# EAGLE design OutputIndicator (EAGLE 9.5.2)
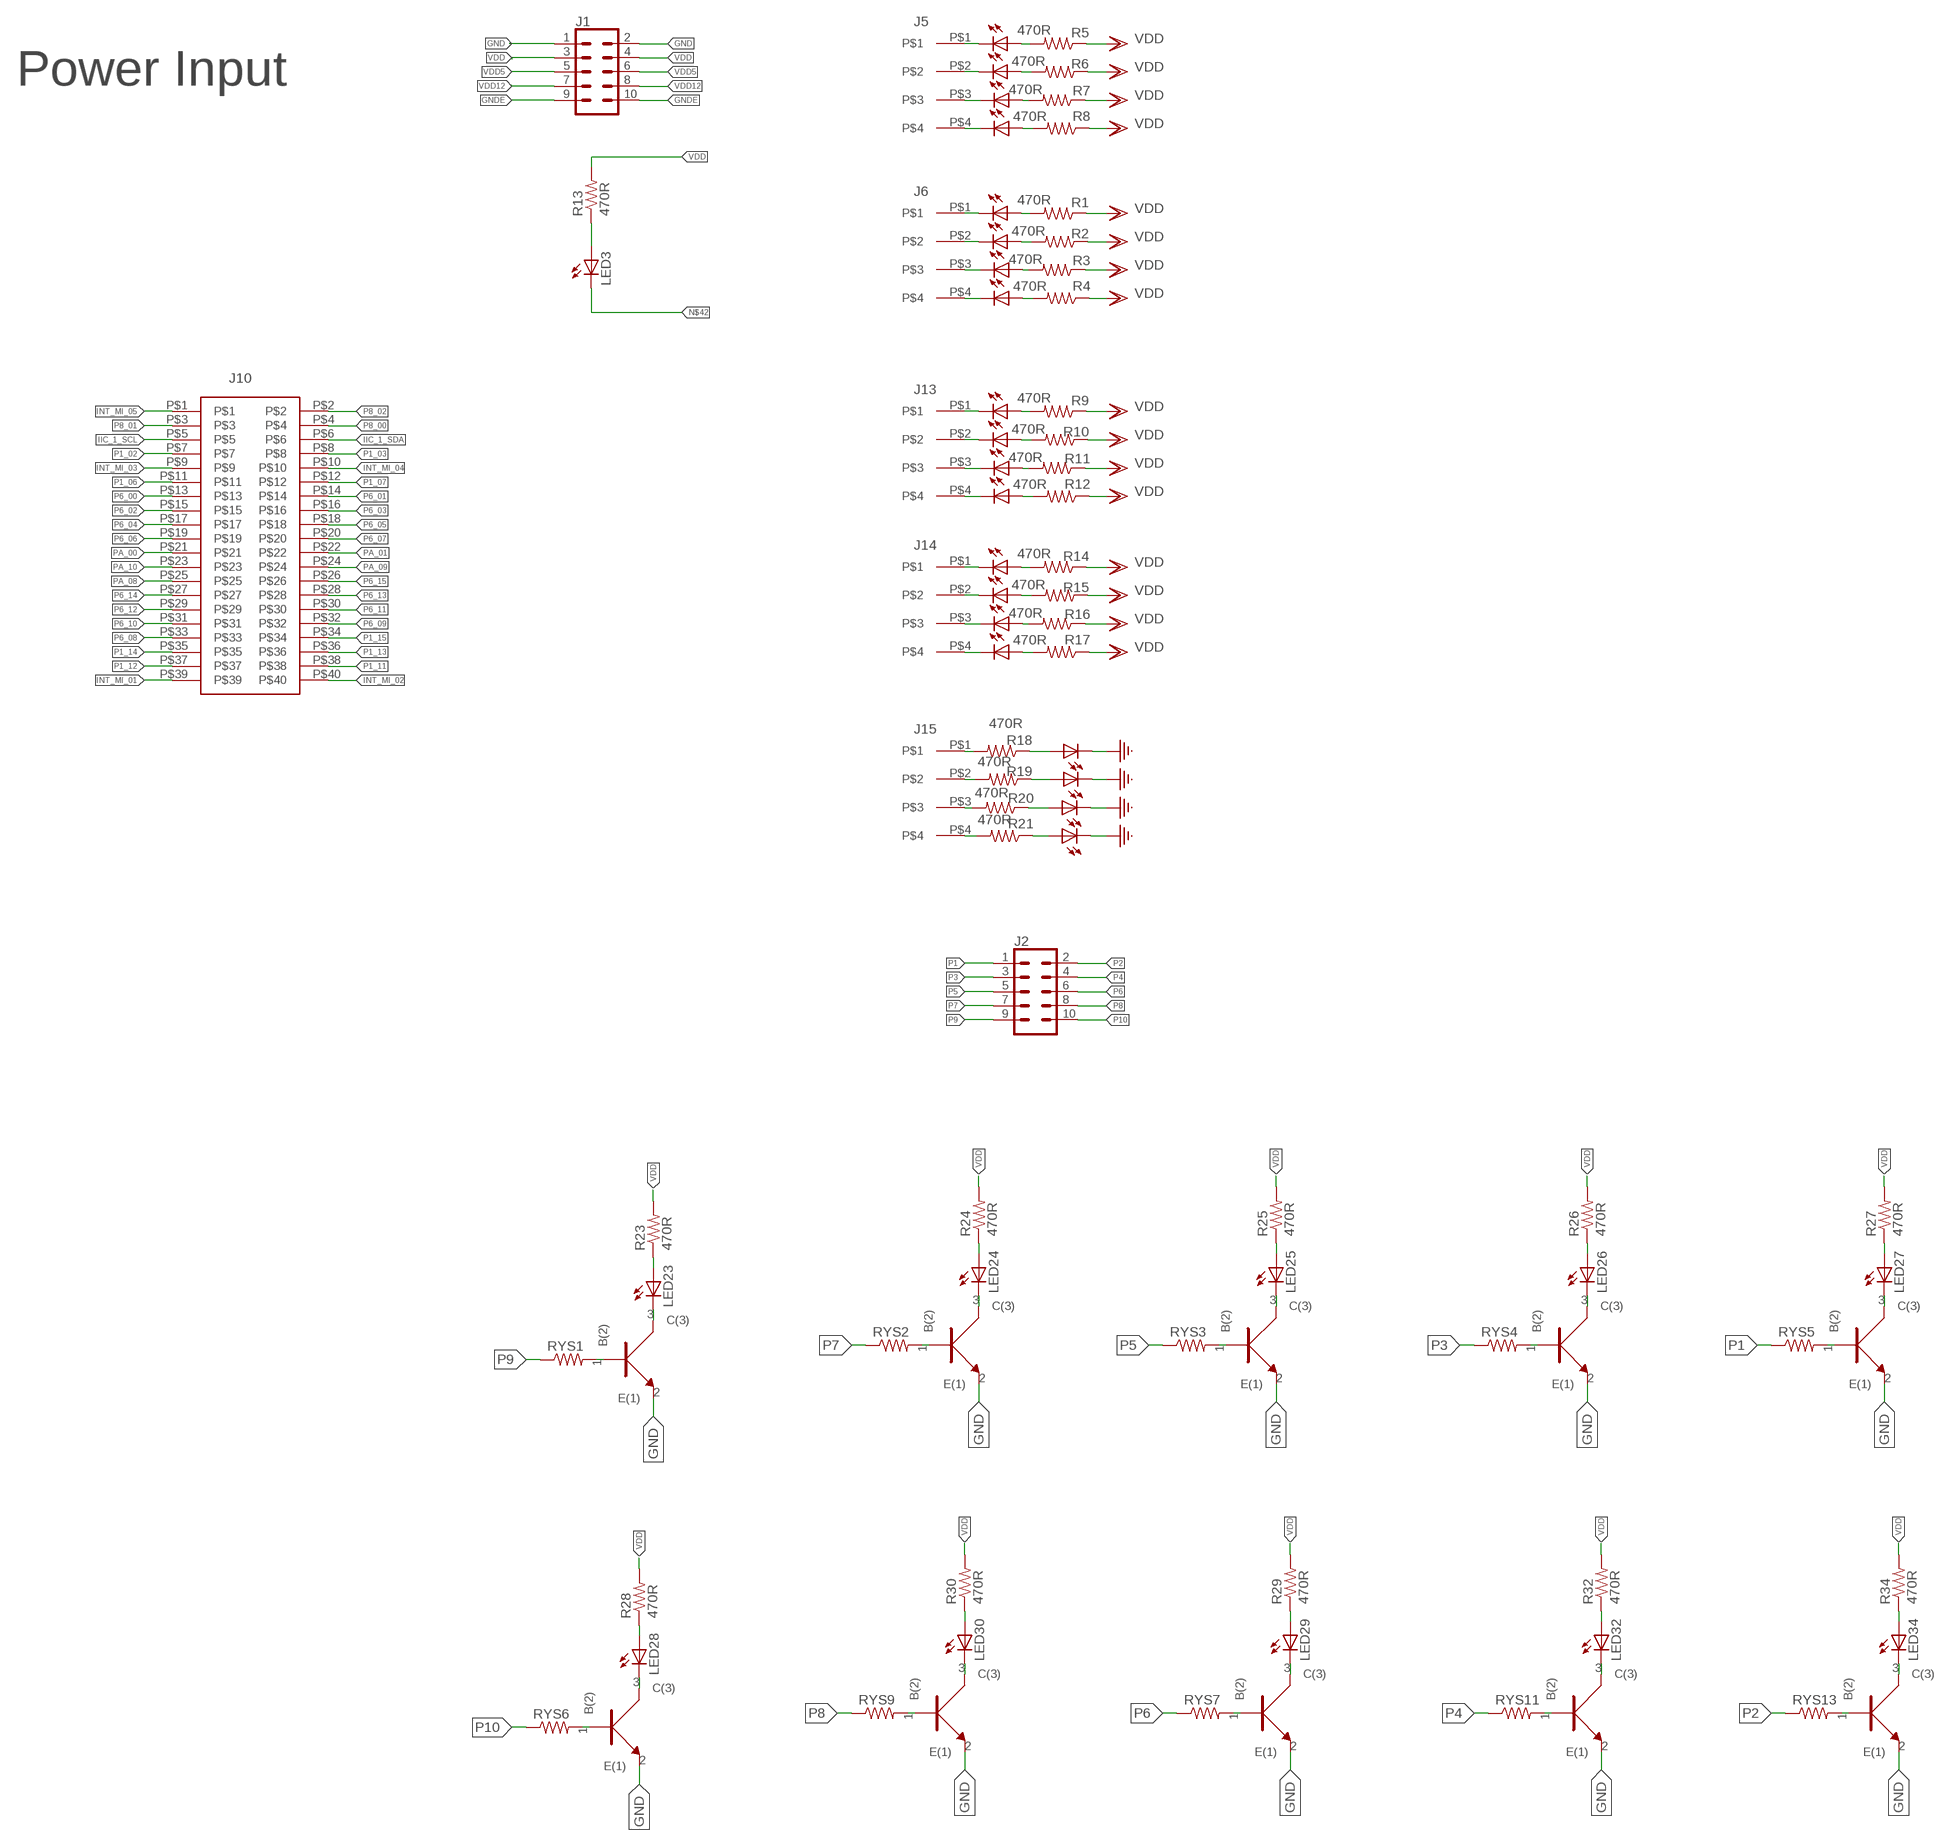
[diagram p0: schematic, sheet 1]

## Parts
J1  CONN_05X2PTH  [2X5]
J2  CONN_05X2NO_SILK  [2X5_NOSILK]
J5  3.81MM_1_X_4_RT_ANGLE_PLUG_HEADER  [1X4_3.81MM_PITCH]
J6  3.81MM_1_X_4_RT_ANGLE_PLUG_HEADER  [1X4_3.81MM_PITCH]
J10  HEADER_2_X_20_GENERIC  [HEADER_2_X_20_.1_INCH]
J13  3.81MM_1_X_4_RT_ANGLE_PLUG_HEADER  [1X4_3.81MM_PITCH]
J14  3.81MM_1_X_4_RT_ANGLE_PLUG_HEADER  [1X4_3.81MM_PITCH]
J15  3.81MM_1_X_4_RT_ANGLE_PLUG_HEADER  [1X4_3.81MM_PITCH]
LED1  LED_0805_GREEN  [LED_0805_GREEN]
LED2  LED_0805_GREEN  [LED_0805_GREEN]
LED3  LED_0805_GREEN  [LED_0805_GREEN]
LED4  LED_0805_GREEN  [LED_0805_GREEN]
LED5  LED_0805_GREEN  [LED_0805_GREEN]
LED6  LED_0805_GREEN  [LED_0805_GREEN]
LED7  LED_0805_GREEN  [LED_0805_GREEN]
LED8  LED_0805_GREEN  [LED_0805_GREEN]
LED9  LED_0805_GREEN  [LED_0805_GREEN]
LED10  LED_0805_GREEN  [LED_0805_GREEN]
LED11  LED_0805_GREEN  [LED_0805_GREEN]
LED12  LED_0805_GREEN  [LED_0805_GREEN]
LED13  LED_0805_GREEN  [LED_0805_GREEN]
LED14  LED_0805_GREEN  [LED_0805_GREEN]
LED15  LED_0805_GREEN  [LED_0805_GREEN]
LED16  LED_0805_GREEN  [LED_0805_GREEN]
LED17  LED_0805_GREEN  [LED_0805_GREEN]
LED18  LED_0805_GREEN  [LED_0805_GREEN]
LED19  LED_0805_GREEN  [LED_0805_GREEN]
LED20  LED_0805_GREEN  [LED_0805_GREEN]
LED21  LED_0805_GREEN  [LED_0805_GREEN]
LED23  LED_0805_GREEN  [LED_0805_GREEN]
LED24  LED_0805_GREEN  [LED_0805_GREEN]
LED25  LED_0805_GREEN  [LED_0805_GREEN]
LED26  LED_0805_GREEN  [LED_0805_GREEN]
LED27  LED_0805_GREEN  [LED_0805_GREEN]
LED28  LED_0805_GREEN  [LED_0805_GREEN]
LED29  LED_0805_GREEN  [LED_0805_GREEN]
LED30  LED_0805_GREEN  [LED_0805_GREEN]
LED32  LED_0805_GREEN  [LED_0805_GREEN]
LED34  LED_0805_GREEN  [LED_0805_GREEN]
R1  470R  R_0402  [0402]
R2  470R  R_0402  [0402]
R3  470R  R_0402  [0402]
R4  470R  R_0402  [0402]
R5  470R  R_0402  [0402]
R6  470R  R_0402  [0402]
R7  470R  R_0402  [0402]
R8  470R  R_0402  [0402]
R9  470R  R_0402  [0402]
R10  470R  R_0402  [0402]
R11  470R  R_0402  [0402]
R12  470R  R_0402  [0402]
R13  470R  R_0402  [0402]
R14  470R  R_0402  [0402]
R15  470R  R_0402  [0402]
R16  470R  R_0402  [0402]
R17  470R  R_0402  [0402]
R18  470R  R_0402  [0402]
R19  470R  R_0402  [0402]
R20  470R  R_0402  [0402]
R21  470R  R_0402  [0402]
R23  470R  R_0402  [0402]
R24  470R  R_0402  [0402]
R25  470R  R_0402  [0402]
R26  470R  R_0402  [0402]
R27  470R  R_0402  [0402]
R28  470R  R_0402  [0402]
R29  470R  R_0402  [0402]
R30  470R  R_0402  [0402]
R32  470R  R_0402  [0402]
R34  470R  R_0402  [0402]
RYS1  1K  R_0402  [0402]
RYS2  1K  R_0402  [0402]
RYS3  1K  R_0402  [0402]
RYS4  1K  R_0402  [0402]
RYS5  1K  R_0402  [0402]
RYS6  1K  R_0402  [0402]
RYS7  1K  R_0402  [0402]
RYS9  1K  R_0402  [0402]
RYS11  1K  R_0402  [0402]
RYS13  1K  R_0402  [0402]
U1  BC846BW  [SOT323]
U2  BC846BW  [SOT323]
U3  BC846BW  [SOT323]
U4  BC846BW  [SOT323]
U5  BC846BW  [SOT323]
U6  BC846BW  [SOT323]
U7  BC846BW  [SOT323]
U8  BC846BW  [SOT323]
U10  BC846BW  [SOT323]
U12  BC846BW  [SOT323]

## Nets
GND: J1.1 J1.2 LED18.C LED19.C LED20.C LED21.C U1.2(E(1)) U2.2(E(1)) U3.2(E(1)) U4.2(E(1)) U5.2(E(1)) U6.2(E(1)) U7.2(E(1)) U8.2(E(1)) U10.2(E(1)) U12.2(E(1))
GNDE: J1.9 J1.10
IIC_1_SCL: J10.P$5
IIC_1_SDA: J10.P$6
INT_MI_01: J10.P$39
INT_MI_02: J10.P$40
INT_MI_03: J10.P$9
INT_MI_04: J10.P$10
INT_MI_05: J10.P$1
N$1: J5.P$1 LED6.C
N$2: J5.P$2 LED7.C
N$3: LED3.A R13.P$1
N$4: J5.P$3 LED8.C
N$5: J5.P$4 LED9.C
N$6: LED9.A R8.P$2
N$7: LED8.A R7.P$2
N$8: LED7.A R6.P$2
N$9: LED6.A R5.P$2
N$10: J6.P$1 LED1.C
N$11: J6.P$2 LED2.C
N$12: J6.P$3 LED4.C
N$13: J6.P$4 LED5.C
N$14: LED5.A R4.P$2
N$15: LED2.A R2.P$2
N$16: LED1.A R1.P$2
N$17: LED4.A R3.P$2
N$18: J13.P$1 LED10.C
N$19: J13.P$2 LED11.C
N$20: J13.P$3 LED12.C
N$21: J13.P$4 LED13.C
N$22: LED13.A R12.P$2
N$23: LED11.A R10.P$2
N$24: LED10.A R9.P$2
N$25: LED12.A R11.P$2
N$26: J14.P$1 LED14.C
N$27: J14.P$2 LED15.C
N$28: J14.P$3 LED16.C
N$29: J14.P$4 LED17.C
N$30: LED17.A R17.P$2
N$31: LED15.A R15.P$2
N$32: LED14.A R14.P$2
N$33: LED16.A R16.P$2
N$34: J15.P$4 R21.P$2
N$35: J15.P$3 R20.P$2
N$36: J15.P$2 R19.P$2
N$37: J15.P$1 R18.P$2
N$38: LED18.A R18.P$1
N$39: LED19.A R19.P$1
N$40: LED20.A R20.P$1
N$41: LED21.A R21.P$1
N$42: LED3.C
N$45: RYS1.P$2 U1.1(B(2))
N$46: LED23.A R23.P$1
N$47: LED23.C U1.3(C(3))
N$48: RYS2.P$2 U2.1(B(2))
N$49: LED24.A R24.P$1
N$50: LED24.C U2.3(C(3))
N$51: RYS3.P$2 U3.1(B(2))
N$52: LED25.A R25.P$1
N$53: LED25.C U3.3(C(3))
N$54: RYS4.P$2 U4.1(B(2))
N$55: LED26.A R26.P$1
N$56: LED26.C U4.3(C(3))
N$57: RYS5.P$2 U5.1(B(2))
N$58: LED27.A R27.P$1
N$59: LED27.C U5.3(C(3))
N$60: RYS6.P$2 U6.1(B(2))
N$61: LED28.A R28.P$1
N$62: LED28.C U6.3(C(3))
N$63: RYS7.P$2 U7.1(B(2))
N$64: LED29.A R29.P$1
N$65: LED29.C U7.3(C(3))
N$66: RYS9.P$2 U8.1(B(2))
N$67: LED30.A R30.P$1
N$68: LED30.C U8.3(C(3))
N$72: RYS11.P$2 U10.1(B(2))
N$73: LED32.A R32.P$1
N$74: LED32.C U10.3(C(3))
N$78: RYS13.P$2 U12.1(B(2))
N$79: LED34.A R34.P$1
N$80: LED34.C U12.3(C(3))
P1: J2.1 RYS5.P$1
P1_02: J10.P$7
P1_03: J10.P$8
P1_06: J10.P$11
P1_07: J10.P$12
P1_11: J10.P$38
P1_12: J10.P$37
P1_13: J10.P$36
P1_14: J10.P$35
P1_15: J10.P$34
P2: J2.2 RYS13.P$1
P3: J2.3 RYS4.P$1
P4: J2.4 RYS11.P$1
P5: J2.5 RYS3.P$1
P6: J2.6 RYS7.P$1
P6_00: J10.P$13
P6_01: J10.P$14
P6_02: J10.P$15
P6_03: J10.P$16
P6_04: J10.P$17
P6_05: J10.P$18
P6_06: J10.P$19
P6_07: J10.P$20
P6_08: J10.P$33
P6_09: J10.P$32
P6_10: J10.P$31
P6_11: J10.P$30
P6_12: J10.P$29
P6_13: J10.P$28
P6_14: J10.P$27
P6_15: J10.P$26
P7: J2.7 RYS2.P$1
P8: J2.8 RYS9.P$1
P8_00: J10.P$4
P8_01: J10.P$3
P8_02: J10.P$2
P9: J2.9 RYS1.P$1
P10: J2.10 RYS6.P$1
PA_00: J10.P$21
PA_01: J10.P$22
PA_08: J10.P$25
PA_09: J10.P$24
PA_10: J10.P$23
VDD: J1.3 J1.4 R1.P$1 R2.P$1 R3.P$1 R4.P$1 R5.P$1 R6.P$1 R7.P$1 R8.P$1 R9.P$1 R10.P$1 R11.P$1 R12.P$1 R13.P$2 R14.P$1 R15.P$1 R16.P$1 R17.P$1 R23.P$2 R24.P$2 R25.P$2 R26.P$2 R27.P$2 R28.P$2 R29.P$2 R30.P$2 R32.P$2 R34.P$2
VDD5: J1.5 J1.6
VDD12: J1.7 J1.8

## Notes on the sheet
- Power Input

## Library data of the parts
J1 = 3D_MIG_Controller:CONN_05X2: Multi connection point. Often used as Generic Header-pin footprint for 0.1 inch spaced/style header connections For AVR SPI programming port, see special device with nice symbol: "AVR_SPI_PROG_5x2.dev" You can populate with any combo of single row headers, but if you'd like an exact match, check these: 2x5 AVR ICSP Male Header <https://www.sparkfun.com/products/778> (PRT-00778) 2x5 Pin Shrouded Header <https://www.sparkfun.com/products/8506> (PRT-08506) On any of the 0.1 inch spaced packages, you can populate with these: Break Away Headers - Straight <https://www.sparkfun.com/products/116> (PRT-00116) Break Away Male Headers - Right Angle <https://www.sparkfun.com/products/553> (PRT-00553) Female Headers <https://www.sparkfun.com/products/115> (PRT-00115) Break Away Headers - Machine Pin <https://www.sparkfun.com/products/117> (PRT-00117) Break Away Female Headers - Swiss Machine Pin <https://www.sparkfun.com/products/743> (PRT-00743) Special note: the shrouded connector mates well with our 5x2 ribbon cables: 2x5 Pin IDC Ribbon Cable <https://www.sparkfun.com/products/8535> (PRT-08535); PROD_ID: CONN-08499; SF_ID: PRT-0778
J2 = 3D_MIG_Controller:CONN_05X2: Multi connection point. Often used as Generic Header-pin footprint for 0.1 inch spaced/style header connections For AVR SPI programming port, see special device with nice symbol: "AVR_SPI_PROG_5x2.dev" You can populate with any combo of single row headers, but if you'd like an exact match, check these: 2x5 AVR ICSP Male Header <https://www.sparkfun.com/products/778> (PRT-00778) 2x5 Pin Shrouded Header <https://www.sparkfun.com/products/8506> (PRT-08506) On any of the 0.1 inch spaced packages, you can populate with these: Break Away Headers - Straight <https://www.sparkfun.com/products/116> (PRT-00116) Break Away Male Headers - Right Angle <https://www.sparkfun.com/products/553> (PRT-00553) Female Headers <https://www.sparkfun.com/products/115> (PRT-00115) Break Away Headers - Machine Pin <https://www.sparkfun.com/products/117> (PRT-00117) Break Away Female Headers - Swiss Machine Pin <https://www.sparkfun.com/products/743> (PRT-00743) Special note: the shrouded connector mates well with our 5x2 ribbon cables: 2x5 Pin IDC Ribbon Cable <https://www.sparkfun.com/products/8535> (PRT-08535)
J5 J6 J13-J15 = 3D_MIG_Controller:3.81MM_1_X_4_RT_ANGLE_PLUG_HEADER
J10 = 3D_MIG_Controller:HEADER_2_X_20_GENERIC
LED1-LED21 LED23-LED30 LED32 LED34 = 3D_MIG_Controller:LED_0805_GREEN
R1-R21 R23-R30 R32 R34 RYS1-RYS7 RYS9 RYS11 RYS13 = 3D_MIG_Controller:R_0402
U1-U8 U10 U12 = 3D_MIG_Controller:BC846BW; MANUFACTURER_PART_NUMBER: BC846BW; VENDOR: Nexperia

## Board
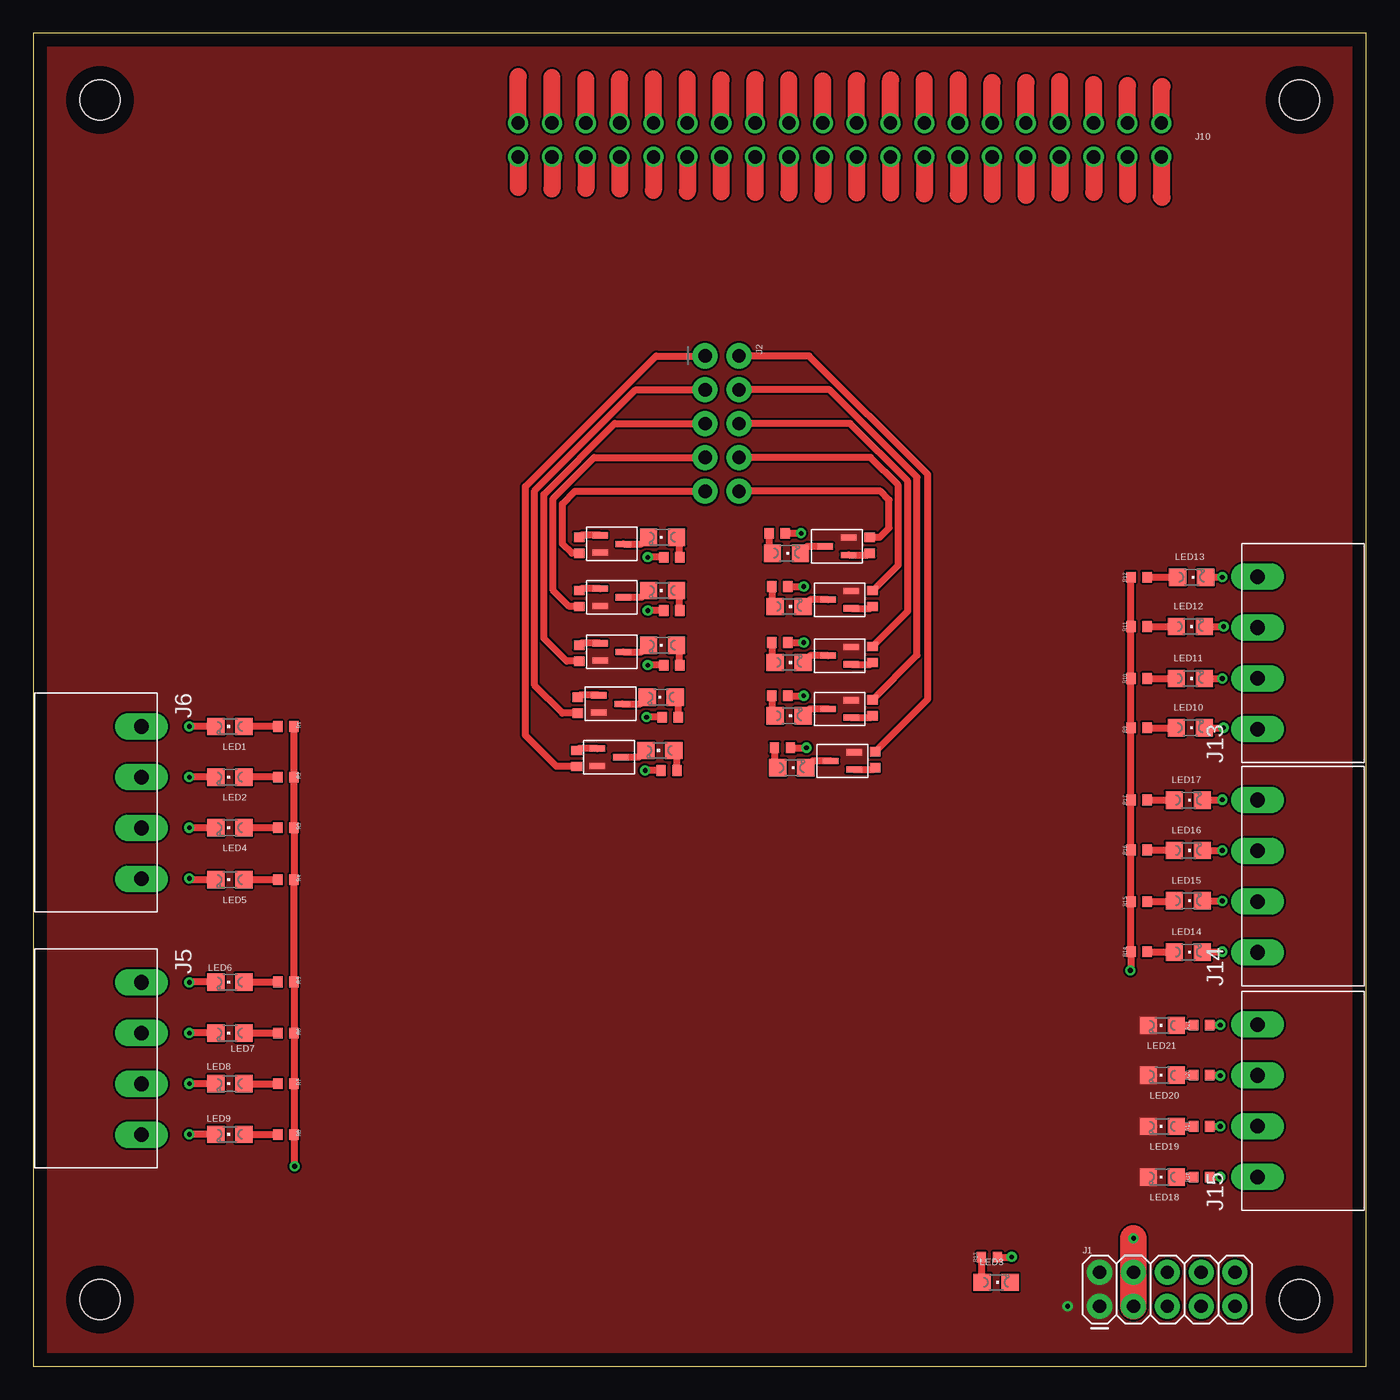
[diagram p1: board, top side]
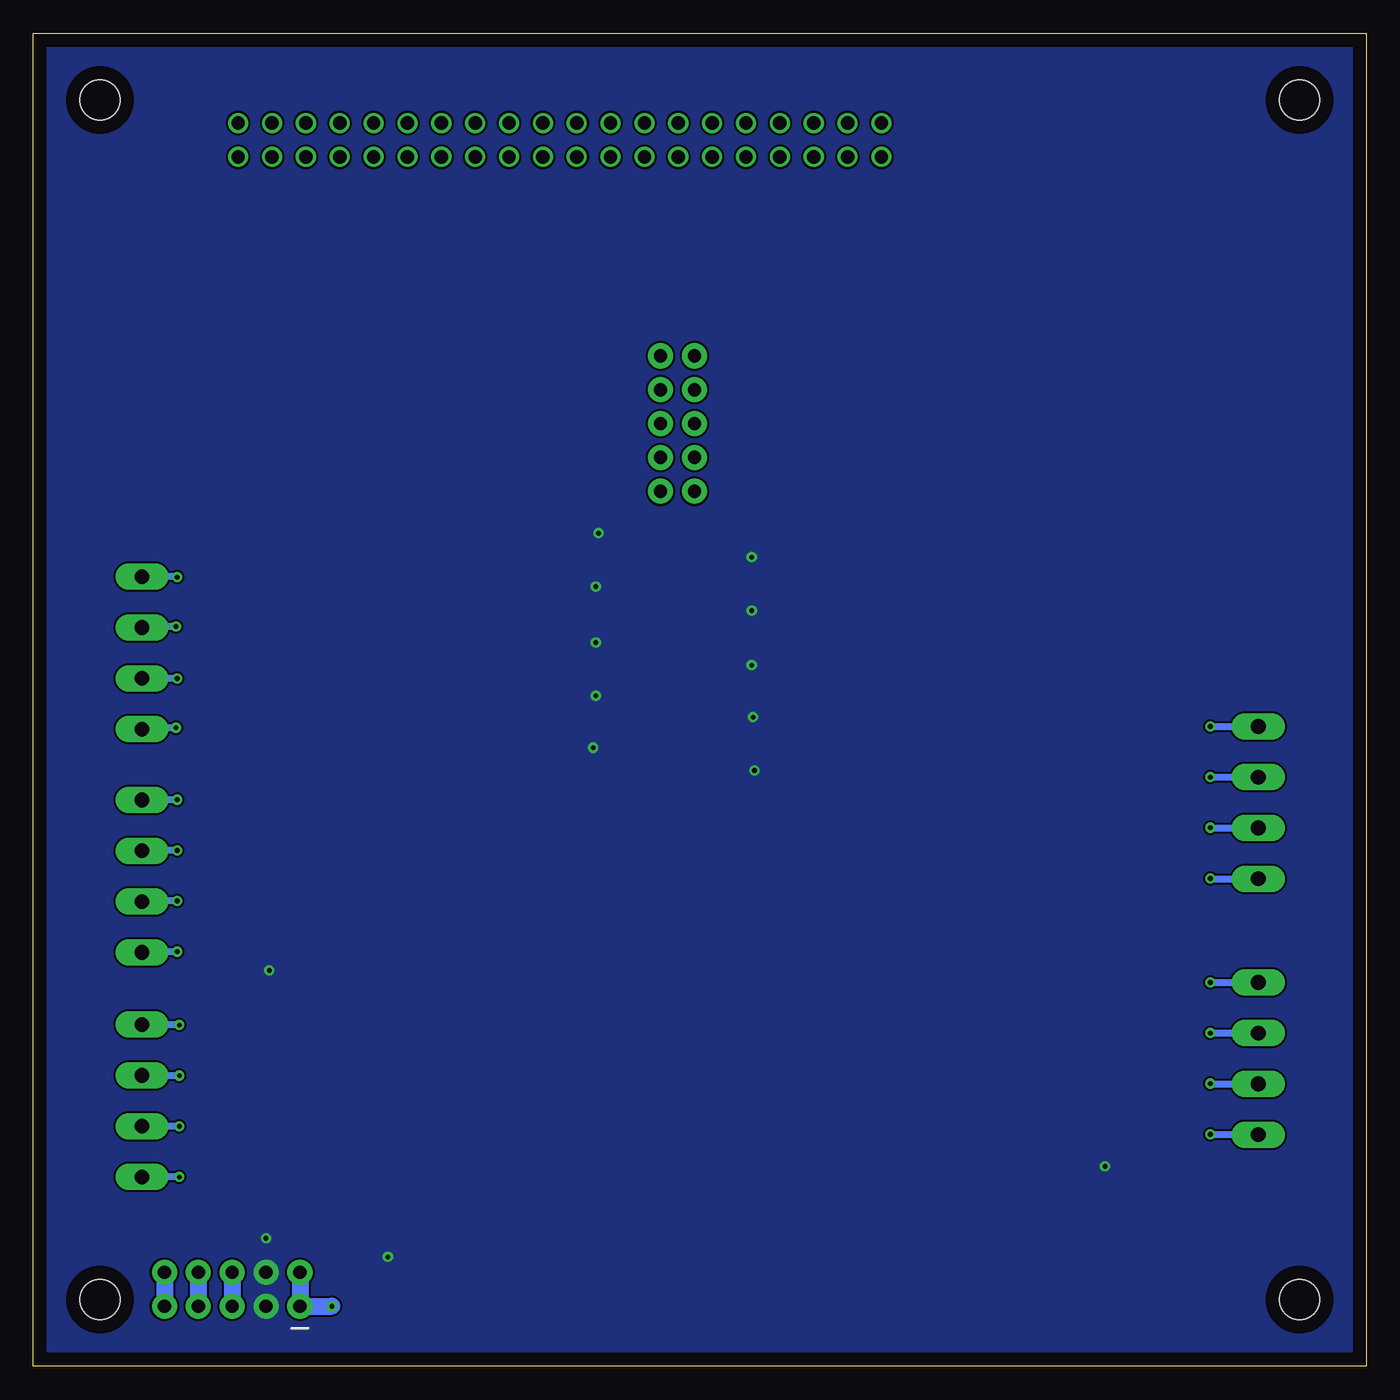
[diagram p2: board, bottom side, seen from below]

Size 100 x 100 mm. Coordinates in mm from the lower left corner, seen from the top.
Outline: 0,0 100,0 100,100 0,100 0,0
Copper layers (1*16): Top 0.035mm / dielectric 1.5mm / Bottom 0.035mm
Design rules "default": minimum track width 6mil, minimum drill 0.35mm, track to track 6mil, track to pad 6mil, pad to pad 6mil, via to via 6mil, smd to smd 6mil, copper to edge 40mil, drill to drill 6mil, minimum pad ring 10mil, minimum via ring 8mil, stop-mask expansion 4mil, vias tented up to drill 0mil, thermal gap 10mil
Holes 3 mm at 5,5 95,5 5,95 95,95

### Footprints (pad centres in the part's own frame; a part is rotated, then mirrored left to right if it is on the bottom)
2X5 = drill 1 pad 1.88: 1 0,0; 2 0,2.54; 3 2.54,0; 4 2.54,2.54; 5 5.08,0; 6 5.08,2.54; 7 7.62,0; 8 7.62,2.54; 9 10.16,0; 10 10.16,2.54
2X5_NOSILK = drill 1 pad 1.88: 1 0,0; 2 0,2.54; 3 2.54,0; 4 2.54,2.54; 5 5.08,0; 6 5.08,2.54; 7 7.62,0; 8 7.62,2.54; 9 10.16,0; 10 10.16,2.54
1X4_3.81MM_PITCH = drill 1.1 pad 2 long: P$1 0,0; P$2 3.81,0; P$3 7.62,0; P$4 11.43,0
HEADER_2_X_20_.1_INCH = drill 1: P$1 -24.13,-1.27; P$2 -24.13,1.27; P$3 -21.59,-1.27; P$4 -21.59,1.27; P$5 -19.05,-1.27; P$6 -19.05,1.27; P$7 -16.51,-1.27; P$8 -16.51,1.27; P$9 -13.97,-1.27; P$10 -13.97,1.27; P$11 -11.43,-1.27; P$12 -11.43,1.27; P$13 -8.89,-1.27; P$14 -8.89,1.27; P$15 -6.35,-1.27; P$16 -6.35,1.27; P$17 -3.81,-1.27; P$18 -3.81,1.27; P$19 -1.27,-1.27; P$20 -1.27,1.27; P$21 1.27,-1.27; P$22 1.27,1.27; P$23 3.81,-1.27; P$24 3.81,1.27; P$25 6.35,-1.27; P$26 6.35,1.27; P$27 8.89,-1.27; P$28 8.89,1.27; P$29 11.43,-1.27; P$30 11.43,1.27; P$31 13.97,-1.27; P$32 13.97,1.27; P$33 16.51,-1.27; P$34 16.51,1.27; P$35 19.05,-1.27; P$36 19.05,1.27; P$37 21.59,-1.27; P$38 21.59,1.27; P$39 24.13,-1.27; P$40 24.13,1.27
LED_0805_GREEN = smd 1.3 x 1.3: A 0,-1.05; C 0,1.05
0402 = smd 0.8 x 0.7: P$1 0,0.6; P$2 0,-0.6
SOT323 = smd 0.457 x 1.168: 1 -0.65,-0.876; 2 0.65,-0.876; 3 0,0.876

### Placement (x,y rotation side)
J1  80,4.5 0 top
J2  50.4,75.8 270 top
J5  8.1,28.8 270 top
J6  8.1,48 270 top
J10  60.5,92 0 top
J13  91.85,47.8 90 top
J14  91.85,31.05 90 top
J15  91.85,14.2 90 top
LED1  14.75,48 90 top
LED2  14.75,44.2 90 top
LED3  72.24,6.29 270 top
LED4  14.75,40.4 90 top
LED5  14.75,36.5 90 top
LED6  14.75,28.82 90 top
LED7  14.75,25 90 top
LED8  14.75,21.2 90 top
LED9  14.75,17.4 90 top
LED10  86.8,47.9 270 top
LED11  86.8,51.6 270 top
LED12  86.8,55.5 270 top
LED13  86.9,59.2 270 top
LED14  86.66,31.07 270 top
LED15  86.66,34.92 270 top
LED16  86.66,38.69 270 top
LED17  86.66,42.47 270 top
LED18  84.71,14.2 90 top
LED19  84.71,18 90 top
LED20  84.71,21.83 90 top
LED21  84.71,25.57 90 top
LED23  47.2,62.2 90 top
LED24  47.2,58.2 90 top
LED25  47.2,54.1 90 top
LED26  47.1,50.2 90 top
LED27  47,46.2 90 top
LED28  56.5,61 270 top
LED29  56.7,52.8 270 top
LED30  56.7,57 270 top
LED32  56.7,48.8 270 top
LED34  56.9,44.9 270 top
R1  18.95,48 270 top
R2  18.95,44.2 270 top
R3  18.95,40.4 270 top
R4  18.95,36.5 270 top
R5  18.95,28.83 270 top
R6  18.95,25 270 top
R7  18.95,21.2 270 top
R8  18.95,17.38 270 top
R9  82.95,47.9 90 top
R10  82.95,51.6 90 top
R11  82.95,55.5 90 top
R12  82.95,59.2 90 top
R13  71.73,8.18 90 top
R14  82.95,31.1 90 top
R15  82.95,34.86 90 top
R16  82.95,38.73 90 top
R17  82.95,42.48 90 top
R18  87.65,14.2 90 top
R19  87.65,18 90 top
R20  87.65,21.85 90 top
R21  87.65,25.58 90 top
R23  47.89,60.7 270 top
R24  47.89,56.7 270 top
R25  47.89,52.6 270 top
R26  47.79,48.7 270 top
R27  47.69,44.7 270 top
R28  55.81,62.5 90 top
R29  56.01,54.3 90 top
R30  56.01,58.5 90 top
R32  56.01,50.3 90 top
R34  56.21,46.4 90 top
RYS1  40.95,61.6 180 top
RYS2  40.95,57.6 180 top
RYS3  40.95,53.5 180 top
RYS4  40.85,49.6 180 top
RYS5  40.75,45.6 180 top
RYS6  62.75,61.6 0 top
RYS7  62.95,53.4 0 top
RYS9  62.95,57.6 0 top
RYS11  62.95,49.4 0 top
RYS13  63.15,45.5 0 top
U1  43.4,61.69 270 top
U2  43.4,57.69 270 top
U3  43.4,53.59 270 top
U4  43.3,49.69 270 top
U5  43.2,45.69 270 top
U6  60.3,61.51 90 top
U7  60.5,53.31 90 top
U8  60.5,57.51 90 top
U10  60.5,49.31 90 top
U12  60.7,45.41 90 top

### Tracks (layer width: path | path; a pad name or v marks a point on that pad's centre or on a via)
GND  (via drill 0.35)
  Bottom 1.27: J1.2 J1.1 v77.6,4.5
  pour Top (no thermals): 0,0 0,100 100,100 100,0
GNDE
  Bottom 1.27: J1.10 J1.9
IIC_1_SCL
  Top 1.27: J10.P$5 41.45,88.35
IIC_1_SDA
  Top 1.27: J10.P$6 41.45,96.55
INT_MI_01
  Top 1.27: J10.P$39 84.63,87.77 84.7,87.7
INT_MI_02
  Top 1.27: J10.P$40 84.63,95.93 84.7,96
INT_MI_03
  Top 1.27: J10.P$9 46.53,88.23
INT_MI_04
  Top 1.27: J10.P$10 46.53,96.57
INT_MI_05
  Top 1.27: J10.P$1 36.37,88.43
N$1  (via drill 0.35)
  Top 0.508: 13.68,28.8 LED6.C 11.72,28.82 v11.7,28.8
  Bottom 0.508: v11.7,28.8 J5.P$1
N$2  (via drill 0.35)
  Top 0.508: LED7.C v11.7,25
  Bottom 0.508: v11.7,25 v11.69,24.99 J5.P$2
N$3
  Top 0.508: R13.P$1 71.13,6.35 LED3.A
N$4  (via drill 0.35)
  Top 0.508: 13.68,21.18 LED8.C v11.7,21.2
  Bottom 0.508: v11.7,21.2 8.12,21.2 J5.P$3
N$5  (via drill 0.35)
  Top 0.508: 13.67,17.37 LED9.C v11.7,17.4
  Bottom 0.508: v11.7,17.4 8.13,17.4 J5.P$4
N$6
  Top 0.508: LED9.A 18.33,17.4 R8.P$2
N$7
  Top 0.508: LED8.A R7.P$2
N$8
  Top 0.508: LED7.A R6.P$2
N$9
  Top 0.508: LED6.A R5.P$2
N$10  (via drill 0.35)
  Top 0.508: LED1.C v11.7,48
  Bottom 0.508: v11.7,48 J6.P$1
N$11  (via drill 0.35)
  Top 0.508: LED2.C v11.7,44.2
  Bottom 0.508: v11.7,44.2 J6.P$2
N$12  (via drill 0.35)
  Top 0.508: LED4.C v11.7,40.4
  Bottom 0.508: v11.7,40.4 8.12,40.4 J6.P$3
N$13  (via drill 0.35)
  Top 0.508: 13.63,36.57 LED5.C 11.8,36.5 v11.7,36.6
  Bottom 0.508: v11.7,36.6 11.67,36.57 J6.P$4
N$14
  Top 0.508: R4.P$2 LED5.A
N$15
  Top 0.508: R2.P$2 LED2.A
N$16
  Top 0.508: R1.P$2 LED1.A
N$17
  Top 0.508: R3.P$2 LED4.A
N$18  (via drill 0.35)
  Top 0.508: LED10.C v89.3,47.9
  Bottom 0.508: v89.3,47.9 91.75,47.9 J13.P$1
N$19  (via drill 0.35)
  Top 0.508: LED11.C v89.2,51.6
  Bottom 0.508: v89.2,51.6 J13.P$2
N$20  (via drill 0.35)
  Top 0.508: LED12.C v89.3,55.5
  Bottom 0.508: v89.3,55.5 91.77,55.5 J13.P$3
N$21  (via drill 0.35)
  Top 0.508: 87.98,59.23 LED13.C v89.2,59.2
  Bottom 0.508: v89.2,59.2 89.23,59.23 J13.P$4
N$22
  Top 0.508: R12.P$2 LED13.A
N$23
  Top 0.508: R10.P$2 LED11.A
N$24
  Top 0.508: R9.P$2 LED10.A
N$25
  Top 0.508: R11.P$2 LED12.A
N$26  (via drill 0.35)
  Top 0.508: LED14.C 89.17,31.07 v89.2,31.1
  Bottom 0.508: v89.2,31.1 91.8,31.1 J14.P$1
N$27  (via drill 0.35)
  Top 0.508: LED15.C 89.18,34.92 v89.2,34.9
  Bottom 0.508: v89.2,34.9 91.81,34.9 J14.P$2
N$28  (via drill 0.35)
  Top 0.508: LED16.C v89.19,38.69 v89.2,38.7
  Bottom 0.508: v89.2,38.7 91.82,38.7 J14.P$3
N$29  (via drill 0.35)
  Top 0.508: LED17.C 89.17,42.47 v89.2,42.5
  Bottom 0.508: v89.2,42.5 91.83,42.5 J14.P$4
N$30
  Top 0.508: R17.P$2 85.59,42.48 LED17.A
N$31
  Top 0.508: R15.P$2 85.55,34.86 LED15.A
N$32
  Top 0.508: R14.P$2 85.58,31.1 LED14.A
N$33
  Top 0.508: R16.P$2 85.56,38.73 LED16.A
N$34  (via drill 0.35)
  Top 0.508: 88.3,25.63 R21.P$2 88.27,25.6 v89.05,25.6
  Bottom 0.508: v89.05,25.6 91.82,25.6 J15.P$4
N$35  (via drill 0.35)
  Top 0.508: R20.P$2 89,21.85 v89.05,21.8
  Bottom 0.508: v89.05,21.8 91.83,21.8 J15.P$3
N$36  (via drill 0.35)
  Top 0.508: R19.P$2 v89.05,18
  Bottom 0.508: v89.05,18 v89.06,18.01 J15.P$2
N$37  (via drill 0.35)
  Top 0.508: R18.P$2 v89.05,14.2
  Bottom 0.508: v89.05,14.2 J15.P$1
N$38
  Top 0.508: R18.P$1 LED18.A
N$39
  Top 0.508: LED19.A R19.P$1
N$40
  Top 0.508: R20.P$1 87.03,21.83 LED20.A
N$41
  Top 0.508: LED21.A R21.P$1
N$45
  Top 0.254: 40.91,62.34 RYS1.P$2
  Top 0.508: U1.1 41.09,62.34 RYS1.P$2
N$46
  Top 0.152: R23.P$1 48.25,60.94
  Top 0.508: R23.P$1 48.49,61.96 LED23.A
N$47
  Top 0.254: 46.08,62.12 LED23.C
  Top 0.508: U1.3 45.64,61.69 46.08,62.12
N$48
  Top 0.254: 40.91,58.34 RYS2.P$2
  Top 0.508: U2.1 41.09,58.34 RYS2.P$2
N$49
  Top 0.152: R24.P$1 48.25,56.94
  Top 0.508: R24.P$1 48.49,57.96 LED24.A
N$50
  Top 0.254: 46.08,58.12 LED24.C
  Top 0.508: U2.3 45.64,57.69 46.08,58.12
N$51
  Top 0.254: 40.91,54.24 RYS3.P$2
  Top 0.508: U3.1 41.09,54.24 RYS3.P$2
N$52
  Top 0.152: R25.P$1 48.25,52.84
  Top 0.508: R25.P$1 48.49,53.86 LED25.A
N$53
  Top 0.254: 46.08,54.02 LED25.C
  Top 0.508: U3.3 45.64,53.59 46.08,54.02
N$54
  Top 0.254: 40.81,50.34 RYS4.P$2
  Top 0.508: U4.1 40.99,50.34 RYS4.P$2
N$55
  Top 0.152: R26.P$1 48.15,48.94
  Top 0.508: R26.P$1 48.39,49.96 LED26.A
N$56
  Top 0.254: 45.98,50.12 LED26.C
  Top 0.508: U4.3 45.54,49.69 45.98,50.12
N$57
  Top 0.254: 40.71,46.34 RYS5.P$2
  Top 0.508: U5.1 40.89,46.34 RYS5.P$2
N$58
  Top 0.152: R27.P$1 48.05,44.94
  Top 0.508: R27.P$1 48.29,45.96 LED27.A
N$59
  Top 0.254: 45.88,46.12 LED27.C
  Top 0.508: U5.3 45.44,45.69 45.88,46.12
N$60
  Top 0.254: 62.79,60.86 RYS6.P$2
  Top 0.508: U6.1 62.61,60.86 RYS6.P$2
N$61
  Top 0.152: R28.P$1 55.45,62.26
  Top 0.508: R28.P$1 55.21,61.24 LED28.A
N$62
  Top 0.254: 57.62,61.08 LED28.C
  Top 0.508: U6.3 58.06,61.51 57.62,61.08
N$63
  Top 0.254: 62.99,52.66 RYS7.P$2
  Top 0.508: U7.1 62.81,52.66 RYS7.P$2
N$64
  Top 0.152: R29.P$1 55.65,54.06
  Top 0.508: R29.P$1 55.41,53.04 LED29.A
N$65
  Top 0.254: 57.83,52.88 LED29.C
  Top 0.508: U7.3 58.26,53.31 57.83,52.88
N$66
  Top 0.254: 62.99,56.86 RYS9.P$2
  Top 0.508: U8.1 62.81,56.86 RYS9.P$2
N$67
  Top 0.152: R30.P$1 55.65,58.26
  Top 0.508: R30.P$1 55.41,57.24 LED30.A
N$68
  Top 0.254: 57.83,57.08 LED30.C
  Top 0.508: U8.3 58.26,57.51 57.83,57.08
N$72
  Top 0.254: 62.99,48.66 RYS11.P$2
  Top 0.508: U10.1 62.81,48.66 RYS11.P$2
N$73
  Top 0.152: R32.P$1 55.65,50.06
  Top 0.508: R32.P$1 55.41,49.04 LED32.A
N$74
  Top 0.254: 57.83,48.88 LED32.C
  Top 0.508: U10.3 58.26,49.31 57.83,48.88
N$78
  Top 0.254: 63.19,44.76 RYS13.P$2
  Top 0.508: U12.1 63.01,44.76 RYS13.P$2
N$79
  Top 0.152: R34.P$1 55.85,46.16
  Top 0.508: R34.P$1 55.61,45.14 LED34.A
N$80
  Top 0.254: 58.02,44.98 LED34.C
  Top 0.508: U12.3 58.46,45.41 58.02,44.98
P1
  Top 0.508: RYS5.P$1 39.25,45 36.93,47.32 36.93,66 46.73,75.8 J2.1
P1_02
  Top 1.27: J10.P$7 43.99,88.31
P1_03
  Top 1.27: J10.P$8 43.99,96.59
P1_06
  Top 1.27: J10.P$11 49.07,88.13
P1_07
  Top 1.27: J10.P$12 49.07,96.57
P1_11
  Top 1.27: J10.P$38 82.09,96.09 82.1,96.1
P1_12
  Top 1.27: J10.P$37 82.09,87.91 82.1,87.9
P1_13
  Top 1.27: J10.P$36 79.55,96.15
P1_14
  Top 1.27: J10.P$35 79.55,88.05
P1_15
  Top 1.27: J10.P$34 77.01,96.39
P2
  Top 0.508: RYS13.P$1 67.1,50.05 67.1,66.9 58.2,75.8 J2.2
P3
  Top 0.508: RYS4.P$1 39.69,49 37.61,51.08 37.61,65.68 45.19,73.26 J2.3
P4
  Top 0.508: RYS11.P$1 66.3,53.35 66.3,66.7 59.74,73.26 J2.4
P5
  Top 0.508: RYS3.P$1 40.01,52.9 38.3,54.61 38.3,65.4 43.62,70.72 J2.5
P6
  Top 0.508: RYS7.P$1 65.6,56.65 65.6,66.4 61.28,70.72 J2.6
P6_00
  Top 1.27: J10.P$13 51.61,88.11 51.6,88.1
P6_01
  Top 1.27: J10.P$14 51.61,96.49
P6_02
  Top 1.27: J10.P$15 54.15,88.05
P6_03
  Top 1.27: J10.P$16 54.15,96.55
P6_04
  Top 1.27: J10.P$17 56.69,88.01
P6_05
  Top 1.27: J10.P$18 56.69,96.49
P6_06
  Top 1.27: J10.P$19 59.23,87.93
P6_07
  Top 1.27: J10.P$20 59.23,96.43
P6_08
  Top 1.27: J10.P$33 77.01,88.01
P6_09
  Top 1.27: J10.P$32 74.47,96.33
P6_10
  Top 1.27: J10.P$31 74.47,87.83
P6_11
  Top 1.27: J10.P$30 71.93,96.33
P6_12
  Top 1.27: J10.P$29 71.93,87.93
P6_13
  Top 1.27: J10.P$28 69.39,96.49
P6_14
  Top 1.27: J10.P$27 69.39,87.91
P6_15
  Top 1.27: J10.P$26 66.85,96.45
P7
  Top 0.508: RYS2.P$1 40.2,57 39,58.2 39,65.1 42.08,68.18 J2.7
P8
  Top 0.508: RYS9.P$1 63,58.2 64.9,60.1 64.9,66.1 62.82,68.18 J2.8
P8_00
  Top 1.27: J10.P$4 38.91,96.69
P8_01
  Top 1.27: J10.P$3 38.91,88.31
P8_02
  Top 1.27: J10.P$2 36.37,96.77
P9
  Top 0.508: RYS1.P$1 40.4,61 39.7,61.7 39.7,64.7 40.64,65.64 J2.9
P10
  Top 0.508: RYS6.P$1 63.5,62.2 64.2,62.9 64.2,65 63.56,65.64 J2.10
PA_00
  Top 1.27: J10.P$21 61.77,88.03
PA_01
  Top 1.27: J10.P$22 61.77,96.47
PA_08
  Top 1.27: J10.P$25 66.85,87.95
PA_09
  Top 1.27: J10.P$24 64.31,96.49
PA_10
  Top 1.27: J10.P$23 64.31,88.01
VDD  (via drill 0.35)
  Top 0.508: 72.35,8.16 R13.P$2 73.38,8.18 v73.4,8.2 | R1.P$1 R2.P$1 R3.P$1 R4.P$1 R5.P$1 R6.P$1 R7.P$1 R8.P$1 19.55,15.05 v19.6,15 | 82.3,31.05 R14.P$1 | R14.P$1 R15.P$1 R16.P$1 R17.P$1 R9.P$1 R10.P$1 R11.P$1 R12.P$1 | R23.P$2 v46.1,60.7 | R24.P$2 v46.1,56.7 | R25.P$2 v46.1,52.6 | R26.P$2 v46,48.7 | R27.P$2 v45.9,44.7 | R28.P$2 v57.6,62.5 | R30.P$2 v57.8,58.5 | R29.P$2 v57.8,54.3 | R32.P$2 v57.8,50.3 | R34.P$2 v58,46.4 | R14.P$1 82.36,29.75 v82.3,29.7
  Top 2: J1.3 J1.4 82.54,9.56 v82.54,9.6
  pour Bottom (no thermals): 0,0 0,100 100,100 100,0
VDD5
  Bottom 1.27: J1.6 J1.5
VDD12
  Bottom 1.27: J1.8 J1.7